# EAGLE design IO_board-ha-v3-rev1 (EAGLE 6.5.0)
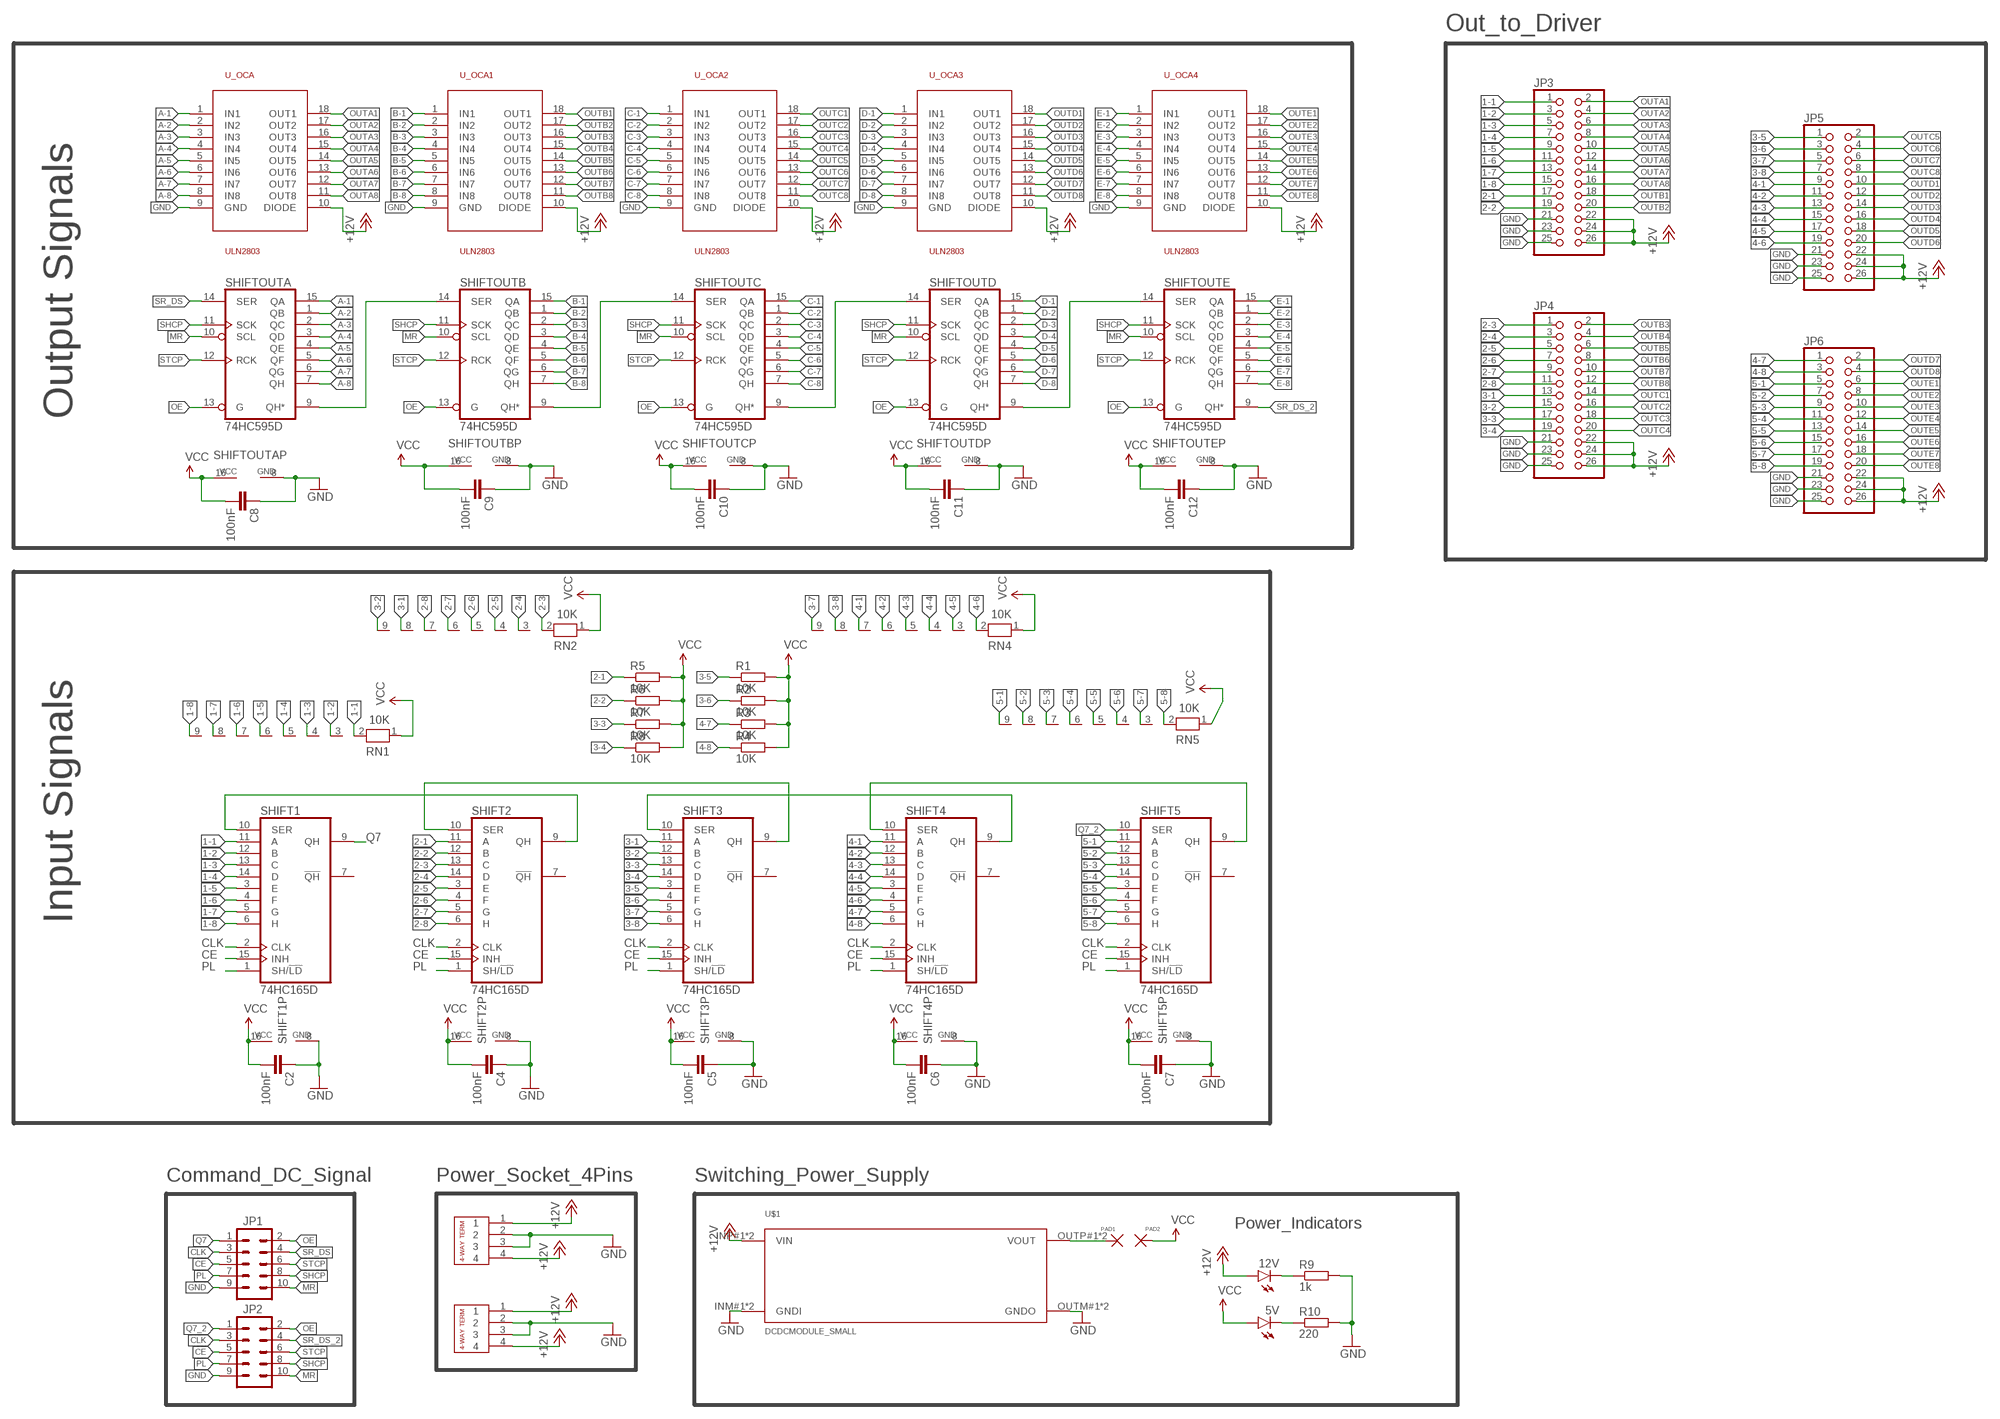
[diagram p0: schematic, sheet 1]

## Parts
5V  LED3MM  [LED3MM]
12V  LED3MM  [LED3MM]
C2  100nF  C-EUC0603K  [C0603K]
C4  100nF  C-EUC0603K  [C0603K]
C5  100nF  C-EUC0603K  [C0603K]
C6  100nF  C-EUC0603K  [C0603K]
C7  100nF  C-EUC0603K  [C0603K]
C8  100nF  C-EUC0603K  [C0603K]
C9  100nF  C-EUC0603K  [C0603K]
C10  100nF  C-EUC0603K  [C0603K]
C11  100nF  C-EUC0603K  [C0603K]
C12  100nF  C-EUC0603K  [C0603K]
J1  4-PIN-CON-1759017  [4-PIN-CON-1759017]
J2  4-PIN-CON-1759017  [4-PIN-CON-1759017]
JP1  M05X2SHD  [2X5-SHROUDED]
JP2  M05X2SHD  [2X5-SHROUDED]
JP3  PINHD-2X13  [2X13]
JP4  PINHD-2X13  [2X13]
JP5  PINHD-2X13  [2X13]
JP6  PINHD-2X13  [2X13]
R1  10K  R-EU_R0603  [R0603]
R2  10K  R-EU_R0603  [R0603]
R3  10K  R-EU_R0603  [R0603]
R4  10K  R-EU_R0603  [R0603]
R5  10K  R-EU_R0603  [R0603]
R6  10K  R-EU_R0603  [R0603]
R7  10K  R-EU_R0603  [R0603]
R8  10K  R-EU_R0603  [R0603]
R9  1k  R-EU_R0805  [R0805]
R10  220  R-EU_R0805  [R0805]
RN1  10K  RN08  [RN-9]
RN2  10K  RN08  [RN-9]
RN4  10K  RN08  [RN-9]
RN5  10K  RN08  [RN-9]
SHIFT1  74HC165D  [SO16]
SHIFT2  74HC165D  [SO16]
SHIFT3  74HC165D  [SO16]
SHIFT4  74HC165D  [SO16]
SHIFT5  74HC165D  [SO16]
SHIFTOUTA  74HC595D  [SO16]
SHIFTOUTB  74HC595D  [SO16]
SHIFTOUTC  74HC595D  [SO16]
SHIFTOUTD  74HC595D  [SO16]
SHIFTOUTE  74HC595D  [SO16]
U$1  DCDCMODULE_SMALL  [DCDCMODULE-SMALL]
U$2  DOUBLE_SMALL_PAD  [DOUBLE_SMALL_PAD]
U_OCA  ULN2803  [SO18L]
U_OCA1  ULN2803  [SO18L]
U_OCA2  ULN2803  [SO18L]
U_OCA3  ULN2803  [SO18L]
U_OCA4  ULN2803  [SO18L]

## Nets
1-1: JP3.1 RN1.2 SHIFT1.11(A)
1-2: JP3.3 RN1.3 SHIFT1.12(B)
1-3: JP3.5 RN1.4 SHIFT1.13(C)
1-4: JP3.7 RN1.5 SHIFT1.14(D)
1-5: JP3.9 RN1.6 SHIFT1.3(E)
1-6: JP3.11 RN1.7 SHIFT1.4(F)
1-7: JP3.13 RN1.8 SHIFT1.5(G)
1-8: JP3.15 RN1.9 SHIFT1.6(H)
2-1: JP3.17 R5.1 SHIFT2.11(A)
2-2: JP3.19 R6.1 SHIFT2.12(B)
2-3: JP4.1 RN2.2 SHIFT2.13(C)
2-4: JP4.3 RN2.3 SHIFT2.14(D)
2-5: JP4.5 RN2.4 SHIFT2.3(E)
2-6: JP4.7 RN2.5 SHIFT2.4(F)
2-7: JP4.9 RN2.6 SHIFT2.5(G)
2-8: JP4.11 RN2.7 SHIFT2.6(H)
3-1: JP4.13 RN2.8 SHIFT3.11(A)
3-2: JP4.15 RN2.9 SHIFT3.12(B)
3-3: JP4.17 R7.1 SHIFT3.13(C)
3-4: JP4.19 R8.1 SHIFT3.14(D)
3-5: JP5.1 R1.1 SHIFT3.3(E)
3-6: JP5.3 R2.1 SHIFT3.4(F)
3-7: JP5.5 RN4.9 SHIFT3.5(G)
3-8: JP5.7 RN4.8 SHIFT3.6(H)
4-1: JP5.9 RN4.7 SHIFT4.11(A)
4-2: JP5.11 RN4.6 SHIFT4.12(B)
4-3: JP5.13 RN4.5 SHIFT4.13(C)
4-4: JP5.15 RN4.4 SHIFT4.14(D)
4-5: JP5.17 RN4.3 SHIFT4.3(E)
4-6: JP5.19 RN4.2 SHIFT4.4(F)
4-7: JP6.1 R3.1 SHIFT4.5(G)
4-8: JP6.3 R4.1 SHIFT4.6(H)
5-1: JP6.5 RN5.9 SHIFT5.11(A)
5-2: JP6.7 RN5.8 SHIFT5.12(B)
5-3: JP6.9 RN5.7 SHIFT5.13(C)
5-4: JP6.11 RN5.6 SHIFT5.14(D)
5-5: JP6.13 RN5.5 SHIFT5.3(E)
5-6: JP6.15 RN5.4 SHIFT5.4(F)
5-7: JP6.17 RN5.3 SHIFT5.5(G)
5-8: JP6.19 RN5.2 SHIFT5.6(H)
+12V [power]: 12V.A J1.1 J1.4 J2.1 J2.4 JP3.22 JP3.24 JP3.26 JP4.22 JP4.24 JP4.26 JP5.22 JP5.24 JP5.26 JP6.22 JP6.24 JP6.26 U$1.INP#1(VIN) U$1.INP#2(VIN) U_OCA1.10(DIODE) U_OCA2.10(DIODE) U_OCA3.10(DIODE) U_OCA4.10(DIODE) U_OCA.10(DIODE)
A-1: SHIFTOUTA.15(QA) U_OCA.1(IN1)
A-2: SHIFTOUTA.1(QB) U_OCA.2(IN2)
A-3: SHIFTOUTA.2(QC) U_OCA.3(IN3)
A-4: SHIFTOUTA.3(QD) U_OCA.4(IN4)
A-5: SHIFTOUTA.4(QE) U_OCA.5(IN5)
A-6: SHIFTOUTA.5(QF) U_OCA.6(IN6)
A-7: SHIFTOUTA.6(QG) U_OCA.7(IN7)
A-8: SHIFTOUTA.7(QH) U_OCA.8(IN8)
B-1: SHIFTOUTB.15(QA) U_OCA1.1(IN1)
B-2: SHIFTOUTB.1(QB) U_OCA1.2(IN2)
B-3: SHIFTOUTB.2(QC) U_OCA1.3(IN3)
B-4: SHIFTOUTB.3(QD) U_OCA1.4(IN4)
B-5: SHIFTOUTB.4(QE) U_OCA1.5(IN5)
B-6: SHIFTOUTB.5(QF) U_OCA1.6(IN6)
B-7: SHIFTOUTB.6(QG) U_OCA1.7(IN7)
B-8: SHIFTOUTB.7(QH) U_OCA1.8(IN8)
C-1: SHIFTOUTC.15(QA) U_OCA2.1(IN1)
C-2: SHIFTOUTC.1(QB) U_OCA2.2(IN2)
C-3: SHIFTOUTC.2(QC) U_OCA2.3(IN3)
C-4: SHIFTOUTC.3(QD) U_OCA2.4(IN4)
C-5: SHIFTOUTC.4(QE) U_OCA2.5(IN5)
C-6: SHIFTOUTC.5(QF) U_OCA2.6(IN6)
C-7: SHIFTOUTC.6(QG) U_OCA2.7(IN7)
C-8: SHIFTOUTC.7(QH) U_OCA2.8(IN8)
CE: JP1.5 JP2.5 SHIFT1.15(INH) SHIFT2.15(INH) SHIFT3.15(INH) SHIFT4.15(INH) SHIFT5.15(INH)
CLK: JP1.3 JP2.3 SHIFT1.2(CLK) SHIFT2.2(CLK) SHIFT3.2(CLK) SHIFT4.2(CLK) SHIFT5.2(CLK)
D-1: SHIFTOUTD.15(QA) U_OCA3.1(IN1)
D-2: SHIFTOUTD.1(QB) U_OCA3.2(IN2)
D-3: SHIFTOUTD.2(QC) U_OCA3.3(IN3)
D-4: SHIFTOUTD.3(QD) U_OCA3.4(IN4)
D-5: SHIFTOUTD.4(QE) U_OCA3.5(IN5)
D-6: SHIFTOUTD.5(QF) U_OCA3.6(IN6)
D-7: SHIFTOUTD.6(QG) U_OCA3.7(IN7)
D-8: SHIFTOUTD.7(QH) U_OCA3.8(IN8)
E-1: SHIFTOUTE.15(QA) U_OCA4.1(IN1)
E-2: SHIFTOUTE.1(QB) U_OCA4.2(IN2)
E-3: SHIFTOUTE.2(QC) U_OCA4.3(IN3)
E-4: SHIFTOUTE.3(QD) U_OCA4.4(IN4)
E-5: SHIFTOUTE.4(QE) U_OCA4.5(IN5)
E-6: SHIFTOUTE.5(QF) U_OCA4.6(IN6)
E-7: SHIFTOUTE.6(QG) U_OCA4.7(IN7)
E-8: SHIFTOUTE.7(QH) U_OCA4.8(IN8)
GND [GND]: C2.1 C4.1 C5.1 C6.1 C7.1 C8.1 C9.1 C10.1 C11.1 C12.1 J1.2 J1.3 J2.2 J2.3 JP1.9 JP2.9 JP3.21 JP3.23 JP3.25 JP4.21 JP4.23 JP4.25 JP5.21 JP5.23 JP5.25 JP6.21 JP6.23 JP6.25 R9.2 R10.2 SHIFT1.8(GND) SHIFT2.8(GND) SHIFT3.8(GND) SHIFT4.8(GND) SHIFT5.8(GND) SHIFTOUTA.8(GND) SHIFTOUTB.8(GND) SHIFTOUTC.8(GND) SHIFTOUTD.8(GND) SHIFTOUTE.8(GND) U$1.INM#1(GNDI) U$1.INM#2(GNDI) U$1.OUTM#1(GNDO) U$1.OUTM#2(GNDO) U_OCA1.9(GND) U_OCA2.9(GND) U_OCA3.9(GND) U_OCA4.9(GND) U_OCA.9(GND)
MR [power]: JP1.10 JP2.10 SHIFTOUTA.10(SCL) SHIFTOUTB.10(SCL) SHIFTOUTC.10(SCL) SHIFTOUTD.10(SCL) SHIFTOUTE.10(SCL)
N$12: U$1.OUTP#1(VOUT) U$1.OUTP#2(VOUT) U$2.PAD1
N$13: 12V.K(C) R9.1
N$17: 5V.K(C) R10.1
N$18: SHIFT2.10(SER) SHIFT3.9(QH)
N$21: SHIFT3.10(SER) SHIFT4.9(QH)
N$22: SHIFT4.10(SER) SHIFT5.9(QH)
N$26: SHIFTOUTA.9(QH*) SHIFTOUTB.14(SER)
N$31: SHIFTOUTC.9(QH*) SHIFTOUTD.14(SER)
N$37: SHIFTOUTB.9(QH*) SHIFTOUTC.14(SER)
N$38: SHIFTOUTD.9(QH*) SHIFTOUTE.14(SER)
N$50: SHIFT1.10(SER) SHIFT2.9(QH)
OE [GND]: JP1.2 JP2.2 SHIFTOUTA.13(G) SHIFTOUTB.13(G) SHIFTOUTC.13(G) SHIFTOUTD.13(G) SHIFTOUTE.13(G)
OUTA1: JP3.2 U_OCA.18(OUT1)
OUTA2: JP3.4 U_OCA.17(OUT2)
OUTA3: JP3.6 U_OCA.16(OUT3)
OUTA4: JP3.8 U_OCA.15(OUT4)
OUTA5: JP3.10 U_OCA.14(OUT5)
OUTA6: JP3.12 U_OCA.13(OUT6)
OUTA7: JP3.14 U_OCA.12(OUT7)
OUTA8: JP3.16 U_OCA.11(OUT8)
OUTB1: JP3.18 U_OCA1.18(OUT1)
OUTB2: JP3.20 U_OCA1.17(OUT2)
OUTB3: JP4.2 U_OCA1.16(OUT3)
OUTB4: JP4.4 U_OCA1.15(OUT4)
OUTB5: JP4.6 U_OCA1.14(OUT5)
OUTB6: JP4.8 U_OCA1.13(OUT6)
OUTB7: JP4.10 U_OCA1.12(OUT7)
OUTB8: JP4.12 U_OCA1.11(OUT8)
OUTC1: JP4.14 U_OCA2.18(OUT1)
OUTC2: JP4.16 U_OCA2.17(OUT2)
OUTC3: JP4.18 U_OCA2.16(OUT3)
OUTC4: JP4.20 U_OCA2.15(OUT4)
OUTC5: JP5.2 U_OCA2.14(OUT5)
OUTC6: JP5.4 U_OCA2.13(OUT6)
OUTC7: JP5.6 U_OCA2.12(OUT7)
OUTC8: JP5.8 U_OCA2.11(OUT8)
OUTD1: JP5.10 U_OCA3.18(OUT1)
OUTD2: JP5.12 U_OCA3.17(OUT2)
OUTD3: JP5.14 U_OCA3.16(OUT3)
OUTD4: JP5.16 U_OCA3.15(OUT4)
OUTD5: JP5.18 U_OCA3.14(OUT5)
OUTD6: JP5.20 U_OCA3.13(OUT6)
OUTD7: JP6.2 U_OCA3.12(OUT7)
OUTD8: JP6.4 U_OCA3.11(OUT8)
OUTE1: JP6.6 U_OCA4.18(OUT1)
OUTE2: JP6.8 U_OCA4.17(OUT2)
OUTE3: JP6.10 U_OCA4.16(OUT3)
OUTE4: JP6.12 U_OCA4.15(OUT4)
OUTE5: JP6.14 U_OCA4.14(OUT5)
OUTE6: JP6.16 U_OCA4.13(OUT6)
OUTE7: JP6.18 U_OCA4.12(OUT7)
OUTE8: JP6.20 U_OCA4.11(OUT8)
PL: JP1.7 JP2.7 SHIFT1.1(SH/!LD) SHIFT2.1(SH/!LD) SHIFT3.1(SH/!LD) SHIFT4.1(SH/!LD) SHIFT5.1(SH/!LD)
Q7: JP1.1 SHIFT1.9(QH)
Q7_2: JP2.1 SHIFT5.10(SER)
SHCP: JP1.8 JP2.8 SHIFTOUTA.11(SCK) SHIFTOUTB.11(SCK) SHIFTOUTC.11(SCK) SHIFTOUTD.11(SCK) SHIFTOUTE.11(SCK)
SR_DS: JP1.4 SHIFTOUTA.14(SER)
SR_DS_2: JP2.4 SHIFTOUTE.9(QH*)
STCP: JP1.6 JP2.6 SHIFTOUTA.12(RCK) SHIFTOUTB.12(RCK) SHIFTOUTC.12(RCK) SHIFTOUTD.12(RCK) SHIFTOUTE.12(RCK)
VCC [power]: 5V.A C2.2 C4.2 C5.2 C6.2 C7.2 C8.2 C9.2 C10.2 C11.2 C12.2 R1.2 R2.2 R3.2 R4.2 R5.2 R6.2 R7.2 R8.2 RN1.1 RN2.1 RN4.1 RN5.1 SHIFT1.16(VCC) SHIFT2.16(VCC) SHIFT3.16(VCC) SHIFT4.16(VCC) SHIFT5.16(VCC) SHIFTOUTA.16(VCC) SHIFTOUTB.16(VCC) SHIFTOUTC.16(VCC) SHIFTOUTD.16(VCC) SHIFTOUTE.16(VCC) U$2.PAD2
Unconnected: SHIFT1.7(!QH) SHIFT2.7(!QH) SHIFT3.7(!QH) SHIFT4.7(!QH) SHIFT5.7(!QH)

## Notes on the sheet
- Out_to_Driver
- Output Signals
- Input Signals
- Command_DC_Signal | Power_Socket_4Pins | Switching_Power_Supply
- Power_Indicators

## Library data of the parts
5V 12V = SparkFun-LED:LED: LEDs Standard schematic elements and footprints for 5mm, 3mm, 1206, and 0603 sized LEDs. 5mm - Spark Fun Electronics SKU : COM-00529 (and others)
C2 C4-C12 = rcl:C-EU: CAPACITOR, European symbol
J1 J2 = maul:4-PIN-CON-1759017
JP1 JP2 = SparkFun-Connectors:M05X2: Header 5x2 Standard 10-pin dual row 0.1" header. Commonly used with AVR-ISP. Use with Spark Fun Electronics SKU: PRT-00778
JP3-JP6 = pinhead:PINHD-2X13: PIN HEADER
R1-R8 = resistor:R-EU_: RESISTOR, European symbol
R9 R10 = rcl:R-EU_: RESISTOR, European symbol
RN1 RN2 RN4 RN5 = resistor-net:RN08: RESISTOR NETWORK; OC_FARNELL: unknown; OC_NEWARK: unknown
SHIFT1-SHIFT5 = 74xx-eu:74*165: 8-bit parallel load SHIFT REGISTER
SHIFTOUTA SHIFTOUTB SHIFTOUTC SHIFTOUTD SHIFTOUTE = 74xx-eu:74*595: 8-bit SHIFT REGISTER, output latch
U$1 = bontor:DCDCMODULE_SMALL
U$2 = maul:DOUBLE_SMALL_PAD
U_OCA U_OCA1-U_OCA4 = uln2803:ULN2803

## Net classes
1 power: width 0.305 mm, drill 0.6 mm, clearance 0.813 mm
2 GND: width 0.305 mm, drill 0.6 mm, clearance 0.508 mm
3 LIVEAC: width 0.508 mm, drill 0.508 mm, clearance 1.27 mm

## Board
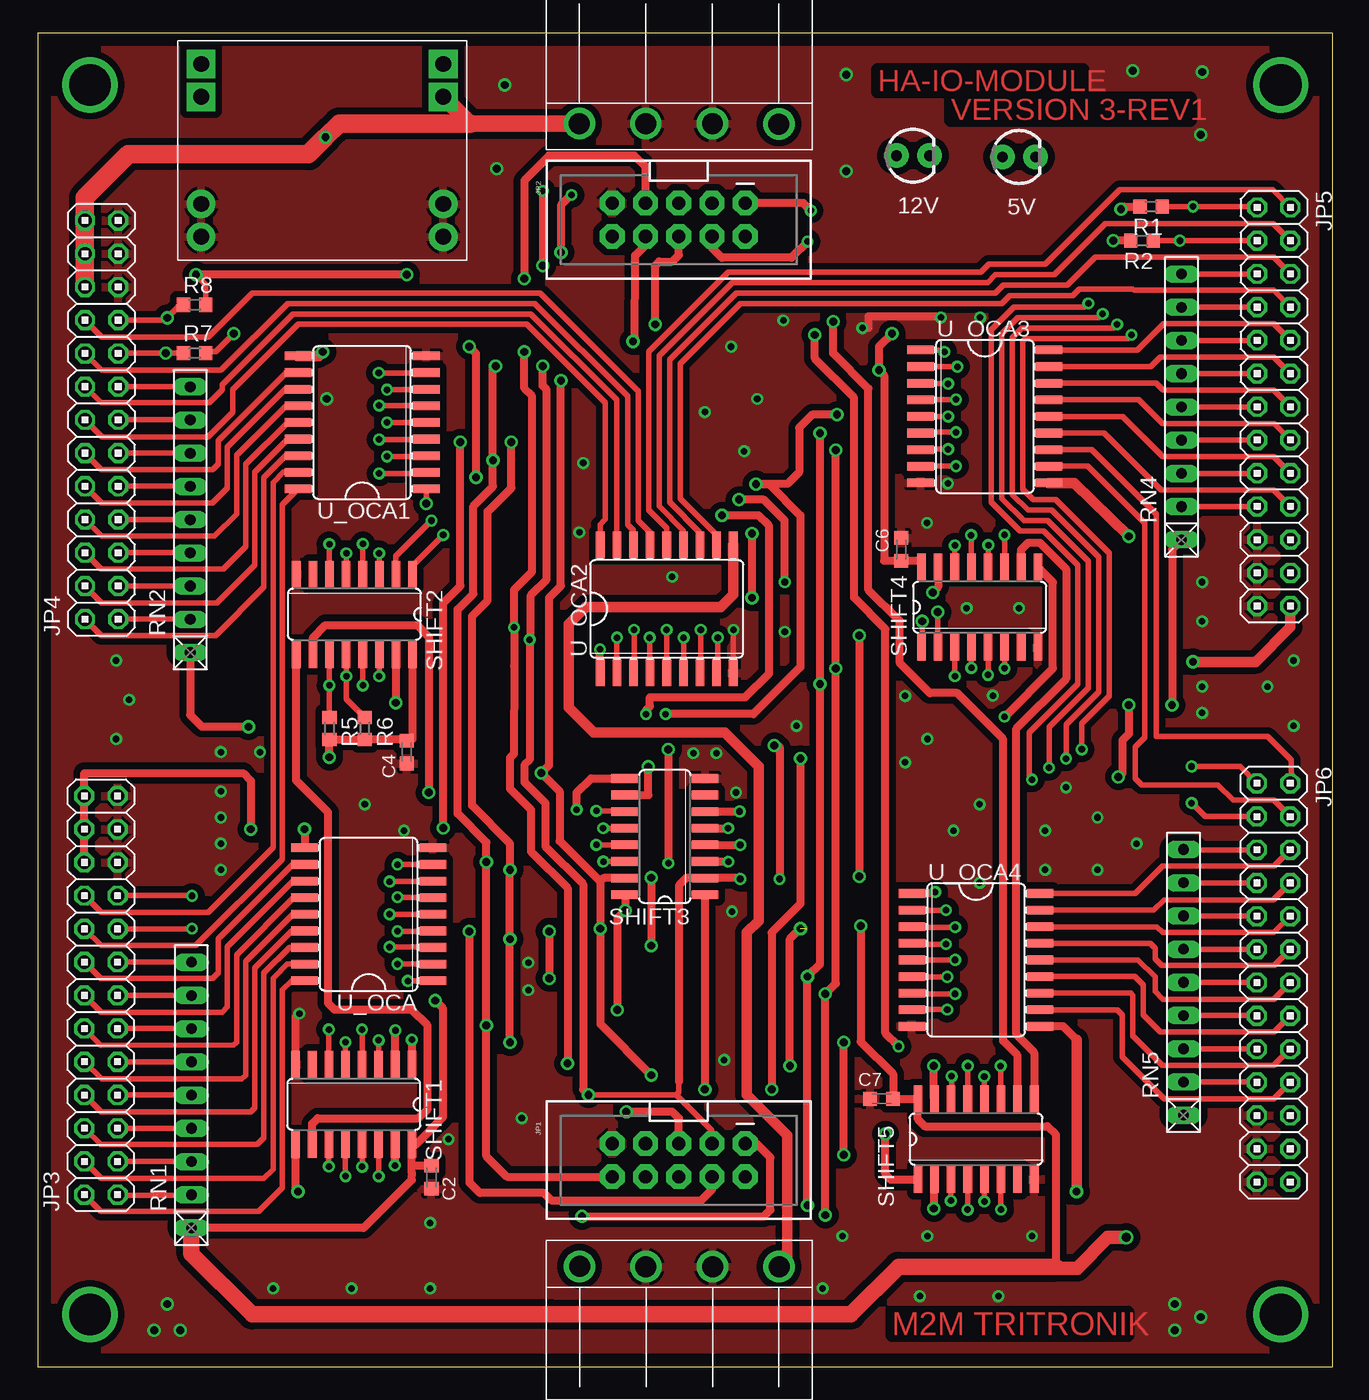
[diagram p1: board, top side]
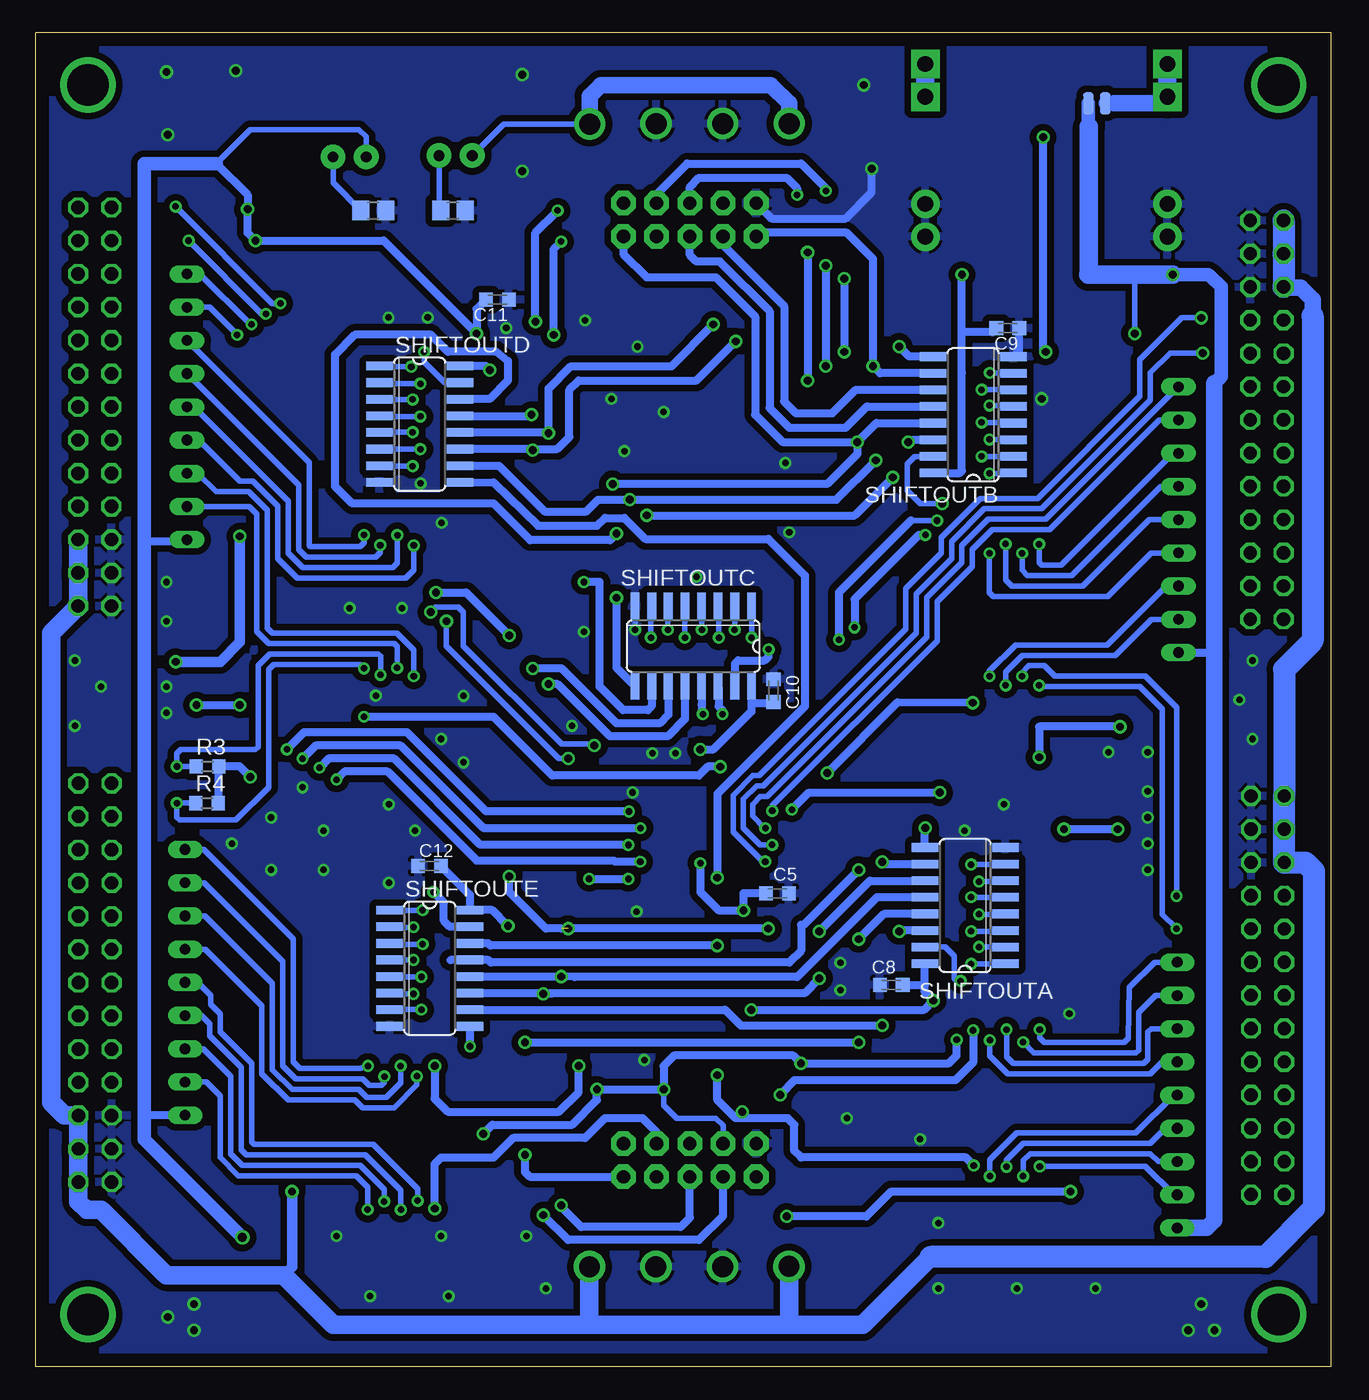
[diagram p2: board, bottom side, seen from below]

Size 99 x 102 mm. Coordinates in mm from the lower left corner, seen from the top.
Outline: 99,0 99,102 0,102 0,0 99,0
Copper layers (1*16): Top 0.035mm / dielectric 1.5mm / Bottom 0.035mm
Design rules "default": minimum track width 10mil, minimum drill 24mil, track to track 8mil, track to pad 8mil, pad to pad 8mil, via to via 8mil, smd to smd 8mil, copper to edge 40mil, drill to drill 8mil, minimum pad ring 10mil, minimum via ring 8mil, stop-mask expansion 4mil, vias tented up to drill 0mil, thermal gap 10mil

### Footprints (pad centres in the part's own frame; a part is rotated, then mirrored left to right if it is on the bottom)
LED3MM = drill 0.813 pad 1.88: A -1.27,0; K 1.27,0
C0603K = smd 1.05 x 1.08: 1 -0.875,0; 2 0.875,0
4-PIN-CON-1759017 = drill 1.6: 1 -7.62,4.13; 2 -2.55,4.1; 3 2.55,4.1; 4 7.63,4.1
2X5-SHROUDED = drill 1.016 pad 1.88 octagon: 1 -1.27,5.08; 2 1.27,5.08; 3 -1.27,2.54; 4 1.27,2.54; 5 -1.27,0; 6 1.27,0; 7 -1.27,-2.54; 8 1.27,-2.54; 9 -1.27,-5.08; 10 1.27,-5.08
2X13 = drill 1.016 octagon: 1 -15.24,-1.27; 2 -15.24,1.27; 3 -12.7,-1.27; 4 -12.7,1.27; 5 -10.16,-1.27; 6 -10.16,1.27; 7 -7.62,-1.27; 8 -7.62,1.27; 9 -5.08,-1.27; 10 -5.08,1.27; 11 -2.54,-1.27; 12 -2.54,1.27; 13 0,-1.27; 14 0,1.27; 15 2.54,-1.27; 16 2.54,1.27; 17 5.08,-1.27; 18 5.08,1.27; 19 7.62,-1.27; 20 7.62,1.27; 21 10.16,-1.27; 22 10.16,1.27; 23 12.7,-1.27; 24 12.7,1.27; 25 15.24,-1.27; 26 15.24,1.27
R0603 = smd 1 x 1.1: 1 -0.85,0; 2 0.85,0
R0805 = smd 1.3 x 1.5: 1 -0.95,0; 2 0.95,0
RN-9 = drill 0.813 long: 1 -10.16,0; 2 -7.62,0; 3 -5.08,0; 4 -2.54,0; 5 0,0; 6 2.54,0; 7 5.08,0; 8 7.62,0; 9 10.16,0
SO16 = smd 0.66 x 2.032: 1 -4.445,-3.073; 2 -3.175,-3.073; 3 -1.905,-3.073; 4 -0.635,-3.073; 5 0.635,-3.073; 6 1.905,-3.073; 7 3.175,-3.073; 8 4.445,-3.073; 9 4.445,3.073; 10 3.175,3.073; 11 1.905,3.073; 12 0.635,3.073; 13 -0.635,3.073; 14 -1.905,3.073; 15 -3.175,3.073; 16 -4.445,3.073
DCDCMODULE-SMALL = drill 1.2 pad 2.184: INM#1 1.8,15; INM#2 1.8,12.5; OUTM#1 20.3,15; OUTM#2 20.3,12.5 | drill 1.2 pad 2.184 square: INP#1 1.8,4.3; INP#2 1.8,1.8; OUTP#1 20.3,4.3; OUTP#2 20.3,1.8
DOUBLE_SMALL_PAD = smd 0.813 x 1.676: PAD1 -0.635,0; PAD2 0.635,0
SO18L = smd 0.66 x 2.032: 1 -5.08,-4.902; 2 -3.81,-4.902; 3 -2.54,-4.902; 4 -1.27,-4.902; 5 0,-4.902; 6 1.27,-4.902; 7 2.54,-4.902; 8 3.81,-4.902; 9 5.08,-4.902; 10 5.08,4.902; 11 3.81,4.902; 12 2.54,4.902; 13 1.27,4.902; 14 0,4.902; 15 -1.27,4.902; 16 -2.54,4.902; 17 -3.81,4.902; 18 -5.08,4.902

### Placement (x,y rotation side)
5V  75,92.5 0 top
12V  66.9,92.6 0 top
C2  30.1,14.5 90 top
C4  28.2,47 90 top
C5  42.3,36.2 180 bottom
C6  66,62.5 270 top
C7  64.5,20.5 0 top
C8  33.6,29.2 0 bottom
C9  24.7,79.4 180 bottom
C10  42.6,51.7 270 bottom
C11  63.7,81.6 180 bottom
C12  68.9,38.3 0 bottom
J1  49.03,99.15 180 top
J2  49.04,3.55 0 top
JP1  49,15.8 270 top
JP2  49,87.7 270 top
JP3  4.84,28.4 90 top
JP4  4.89,72.4 90 top
JP5  94.48,73.4 270 top
JP6  94.46,29.37 270 top
R1  85.1,88.7 180 top
R2  84.4,86.1 180 top
R3  85.86,45.9 0 bottom
R4  85.9,43.1 0 bottom
R5  22.3,48.8 270 top
R6  25,48.8 270 top
R7  12,77.5 0 top
R8  12,81.2 0 top
R9  67.1,88.4 0 bottom
R10  73.2,88.4 0 bottom
RN1  11.75,20.77 90 top
RN2  11.66,64.77 90 top
RN4  87.42,73.39 90 top
RN5  87.57,29.39 90 top
SHIFT1  24.16,20.06 180 top
SHIFT2  24.21,57.53 180 top
SHIFT3  47.94,40.54 90 top
SHIFT4  72,58.08 0 top
SHIFT5  71.72,17.41 0 top
SHIFTOUTA  27.96,35.26 90 bottom
SHIFTOUTB  27.34,72.79 90 bottom
SHIFTOUTC  48.74,55.09 180 bottom
SHIFTOUTD  69.65,72.07 270 bottom
SHIFTOUTE  68.88,30.47 270 bottom
U$1  32.8,101.4 180 top
U$2  17.9,96.6 180 bottom
U_OCA  25.3,34.6 90 top
U_OCA1  24.8,72.2 90 top
U_OCA2  48.08,57.95 0 top
U_OCA3  72.39,72.66 270 top
U_OCA4  71.72,31.11 270 top

### Tracks (layer width: path | path; a pad name or v marks a point on that pad's centre or on a via)
1-1  (via drill 0.5)
  Top 0.406: SHIFT1.11 v22.25,15.32 | JP3.1 6.34,13.16 6.4,13.1 11.7,13.1 RN1.2
  Bottom 0.406: v22.25,15.32 14.18,15.32 11.98,13.15 RN1.2
1-2  (via drill 0.5)
  Top 0.406: SHIFT1.12 v23.52,14.57 | JP3.3 RN1.3
  Bottom 0.406: v23.52,14.57 23.52,15.78 23,16.3 13.8,16.3 13.2,15.7 RN1.3
1-3  (via drill 0.5)
  Top 0.406: SHIFT1.13 v24.8,15.3 | JP3.5 RN1.4
  Bottom 0.406: v24.8,15.3 24.8,15.8 23.5,17.1 13.8,17.1 12.67,18.23 RN1.4
1-4  (via drill 0.5)
  Top 0.406: SHIFT1.14 v26.07,14.56 | JP3.7 RN1.5
  Bottom 0.406: v26.07,14.56 26.07,15.84 24,17.9 14.9,17.9 12.03,20.77 RN1.5
1-5  (via drill 0.5)
  Top 0.406: SHIFT1.3 v26.07,24.96 | JP3.9 RN1.6
  Bottom 0.406: v26.07,24.96 26.07,23.77 24.7,22.4 13.8,22.4 12.89,23.31 RN1.6
1-6  (via drill 0.5)
  Top 0.406: SHIFT1.4 v24.8,25.8 | JP3.11 RN1.7
  Bottom 0.406: v24.8,25.8 24.8,23.7 24.3,23.2 14.3,23.2 14,23.5 14,25.6 13.75,25.85 RN1.7 12.05,25.85
1-7  (via drill 0.5)
  Top 0.406: SHIFT1.5 v23.52,24.82 | JP3.13 RN1.8
  Bottom 0.406: v23.52,24.82 22.7,24 14.9,24 14.7,24.2 14.7,27.1 13.4,28.4 RN1.8 11.91,28.39
1-8  (via drill 0.5)
  Top 0.406: SHIFT1.6 v22.25,25.8 | JP3.15 RN1.9
  Bottom 0.406: v22.25,25.8 22.25,25.16 21.9,24.8 15.8,24.8 15.5,25.1 15.4,29 13.47,30.93 RN1.9 11.97,30.93
2-1  (via drill 0.5)
  Top 0.406: v11.8,33.5 11.78,33.48 JP3.17 | SHIFT2.11 v22.3,52.1 R5.1
  Bottom 0.406: v11.8,33.5 12.9,34.6 12.9,50.3 14.6,52 22.2,52 v22.3,52.1
2-2  (via drill 0.5)
  Top 0.406: SHIFT2.12 23.6,54.46 v23.6,52.8 23.6,51.05 R6.1 | v11.8,36 11.42,36.02 JP3.19
  Bottom 0.406: v23.6,52.8 23.6,53.1 23.1,53.6 21.9,53.6 21.1,52.8 14.2,52.8 11.8,50.4 v11.8,36
2-3  (via drill 0.5)
  Top 0.406: JP4.1 RN2.2 | SHIFT2.13 24.86,54.44 v24.86,52.1
  Bottom 0.406: v24.86,52.1 24.86,53.14 23.6,54.4 16.5,54.4 13.75,57.15 RN2.2
2-4  (via drill 0.5)
  Top 0.406: JP4.3 RN2.3 | SHIFT2.14 26.1,54.44 v26.1,52.8
  Bottom 0.406: v26.1,52.8 26.1,53.2 24.1,55.2 17.1,55.2 12.6,59.7 RN2.3
2-5  (via drill 0.5)
  Top 0.406: JP4.5 RN2.4 | SHIFT2.3 26.1,60.62 v26.1,62.2
  Bottom 0.406: v26.1,62.2 26.1,59.2 25.8,58.9 17.06,58.9 13.73,62.23 RN2.4
2-6  (via drill 0.5)
  Top 0.406: JP4.7 RN2.5 | SHIFT2.4 24.86,60.62 v24.86,62.91
  Bottom 0.406: v24.86,62.91 24.86,60.16 24.4,59.7 18.97,59.7 13.9,64.77 RN2.5
2-7  (via drill 0.5)
  Top 0.406: JP4.9 RN2.6 | SHIFT2.5 23.6,60.63 v23.6,62.2
  Bottom 0.406: 11.69,67.31 RN2.6 13,67.3 19.8,60.5 23.2,60.5 23.6,60.9 v23.6,62.2
2-8  (via drill 0.5)
  Top 0.406: JP4.11 RN2.7 | SHIFT2.6 v22.3,62.9
  Bottom 0.406: v22.3,62.9 22.3,61.5 22.1,61.3 20.6,61.3 12.05,69.85 RN2.7
3-1  (via drill 0.5)
  Top 0.406: JP4.13 RN2.8 | SHIFT3.11 44.66,42.45 44.6,42.5 v42.7,42.5
  Bottom 0.406: RN2.8 13.11,72.39 21.5,64 25.9,64 27.4,62.5 27.4,61.2 30.1,58.5 30.1,55.5 42.7,42.9 v42.7,42.5
3-2  (via drill 0.5)
  Top 0.406: JP4.15 RN2.9 | SHIFT3.12 v43.23,41.17
  Bottom 0.406: v43.23,41.17 43.27,41.17 44.2,42.1 44.2,43 43.6,43.6 43.1,43.6 30.9,55.8 30.9,58.8 28.2,61.5 28.2,62.8 26.2,64.8 21.8,64.8 RN2.9
3-3  (via drill 0.5, 0.6)
  Top 0.406: SHIFT3.13 v42.7,39.91 | JP4.17 6.18,77.5 v9.8,77.5 R7.1
  Bottom 0.406: v42.7,39.91 43.6,39.91 44.9,41.2 44.9,43.4 43.9,44.4 43.4,44.4 31.7,56.1 31.7,59.1 29,61.8 29,63.1 26.5,65.6 22.1,65.6 13.8,73.9 13.8,76 12.3,77.5 v9.8,77.5
3-4  (via drill 0.5, 0.6)
  Top 0.406: SHIFT3.14 v43.23,38.63 | JP4.19 9.72,80.02 v9.9,80.2 10.9,81.2 R8.1
  Bottom 0.406: v43.23,38.63 43.44,38.63 45.7,40.9 45.7,43.7 44.2,45.2 43.7,45.2 32.5,56.4 32.5,59.5 29.8,62.2 29.8,63.4 26.8,66.4 22.4,66.4 14.6,74.2 14.6,77.02 11.42,80.2 v9.9,80.2
3-5  (via drill 0.5)
  Top 0.406: v80.3,81.3 80,81 74.6,81 72.9,79.3 72.9,66.1 75.1,63.9 76.9,63.9 79.5,61.3 79.5,52.2 75.8,48.5 75.8,45.1 v76,44.9 | R1.1 v88.3,88.7 93.15,88.7 JP5.1
  Top 0.61: SHIFT3.3 51.03,38.62 v52.79,38.62
  Bottom 0.406: v80.3,81.3 80.9,81.3 v88.3,88.7 | 93.15,88.7 JP5.1
  Bottom 0.61: v76,44.9 75.4,45.5 72.1,45.5 65.3,38.7 54.8,38.7 54.72,38.62 v52.79,38.62
3-6  (via drill 0.5)
  Top 0.406: JP5.3 v87.3,86.1 R2.1 | v81.4,80.5 81.1,80.2 74.9,80.2 73.7,79 73.7,66.4 75.4,64.7 77.2,64.7 80.3,61.6 80.3,51.9 77.3,48.9 v77.3,45.8
  Top 0.61: SHIFT3.4 v53.7,39.9
  Bottom 0.406: v81.4,80.5 81.7,80.5 v87.3,86.1
  Bottom 0.61: v53.7,39.9 65,39.9 71.6,46.5 76.6,46.5 v77.3,45.8
3-7  (via drill 0.5)
  Top 0.406: RN4.9 JP5.5 | v82.5,79.7 82.2,79.4 75.2,79.4 74.5,78.7 74.5,66.7 75.7,65.5 77.5,65.5 81.1,61.9 81.1,51.6 78.6,49.1 v78.6,46.5
  Top 0.61: SHIFT3.5 v52.77,41.17
  Bottom 0.406: v82.5,79.7 82.6,79.7 86.45,83.55 RN4.9
  Bottom 0.61: v52.77,41.17 64.67,41.17 64.7,41.2 64.8,41.2 71.1,47.5 77.6,47.5 v78.6,46.5
3-8  (via drill 0.5)
  Top 0.406: RN4.8 JP5.7 | v83.6,78.9 83.3,78.6 75.5,78.6 75.3,78.4 75.3,67.1 76.1,66.3 77.8,66.3 81.9,62.2 81.9,51.3 79.8,49.2 v79.8,47.2
  Top 0.61: SHIFT3.6 51.03,42.46 v53.65,42.46
  Bottom 0.406: v83.6,78.9 85.71,81.01 RN4.8
  Bottom 0.61: v53.65,42.46 64.56,42.46 70.6,48.5 78.5,48.5 v79.8,47.2
4-1  (via drill 0.5)
  Top 0.406: RN4.7 JP5.9 | SHIFT4.11 73.91,62.99 v73.9,63.6
  Bottom 0.406: v73.9,63.6 73.9,63 74.2,62.7 78,62.7 78.1,62.8 78.1,69.15 RN4.7
4-2  (via drill 0.5)
  Top 0.406: RN4.6 JP5.11 | SHIFT4.12 72.66,61.18 v72.66,62.82
  Bottom 0.406: v72.66,62.82 72.66,62.24 73,61.9 78.3,61.9 78.9,62.5 78.9,67.41 RN4.6
4-3  (via drill 0.5)
  Top 0.406: RN4.5 JP5.13 | SHIFT4.13 71.35,61.17 v71.35,63.59
  Bottom 0.406: v71.35,63.59 71.35,61.45 71.7,61.1 78.6,61.1 79.7,62.2 79.7,66.2 86.89,73.39 RN4.5
4-4  (via drill 0.5)
  Top 0.406: RN4.4 JP5.15 | SHIFT4.14 70.09,62.99 v70.1,62.8
  Bottom 0.406: v70.1,62.8 70.1,60.9 70.7,60.3 79,60.3 80.5,61.8 80.5,65.8 82.4,67.7 83.4,67.7 86.55,70.85 RN4.4
4-5  (via drill 0.5)
  Top 0.406: RN4.3 JP5.17 | SHIFT4.3 v70.1,52.8
  Bottom 0.406: v70.1,52.8 70.1,54.8 71.4,56.1 80.9,56.1 81.3,56.5 81.3,65.5 82.7,66.9 85.2,66.9 86.6,68.3 RN4.3
4-6  (via drill 0.5)
  Top 0.406: RN4.2 JP5.19 | SHIFT4.4 v71.36,53.44
  Bottom 0.406: v71.36,53.44 71.36,55.06 71.6,55.3 81.2,55.3 82.1,56.2 82.1,65.2 82.67,65.77 RN4.2
4-7  (via drill 0.5)
  Top 0.406: SHIFT4.5 v72.64,52.9 | JP6.1 91.9,45.9 v88.2,45.9
  Bottom 0.406: v72.64,52.9 72.64,54.34 72.8,54.5 81.1,54.5 82,53.6 82,47.4 82.2,47.2 87.9,47.2 88.2,46.9 v88.2,45.9 R3.1
4-8  (via drill 0.5)
  Top 0.406: SHIFT4.6 v73.9,53.4 | JP6.3 89.23,42.07 v88.2,43.1
  Bottom 0.406: v73.9,53.4 74.2,53.7 80.8,53.7 81.2,53.3 81.2,44.3 83.7,41.8 88,41.8 88.2,42 v88.2,43.1 R4.1
5-1  (via drill 0.5)
  Top 0.406: RN5.9 87.95,39.55 88,39.5 93.16,39.5 JP6.5 | SHIFT5.11 73.6,20.51 v73.6,23
  Bottom 0.406: v73.6,23 74.2,22.8 78.8,22.8 79.3,23.3 79.3,32.7 86.15,39.55 RN5.9
5-2  (via drill 0.5)
  Top 0.406: RN5.8 93.17,37.01 JP6.7 | SHIFT5.12 v72.35,22.2
  Bottom 0.406: v72.35,22.2 72.35,21.75 72.6,21.5 73.5,21.5 74,22 79.1,22 80.1,23 80.1,31 86.1,37 RN5.8
5-3  (via drill 0.5)
  Top 0.406: RN5.7 93.17,34.47 JP6.9 | SHIFT5.13 71.1,20.5 v71.1,23
  Bottom 0.406: v71.1,23 71.1,21.7 72.2,20.6 73.7,20.6 74.3,21.2 79.4,21.2 80.9,22.7 80.9,29.3 86.07,34.47 RN5.7
5-4  (via drill 0.5)
  Top 0.406: RN5.6 93.17,31.93 JP6.11 | SHIFT5.14 69.86,20.53 v69.86,22.21
  Bottom 0.406: v69.86,22.21 69.86,21.54 71.6,19.8 74,19.8 74.6,20.4 79.7,20.4 81.7,22.4 81.7,27.6 86.03,31.93 RN5.6
5-5  (via drill 0.5)
  Top 0.406: RN5.5 93.17,29.39 JP6.13 | SHIFT5.3 69.8,14.32 v69.8,12.7
  Bottom 0.406: v69.8,12.7 69.8,13.6 73.2,17 82.3,17 82.5,17.2 82.5,23.2 84.9,25.6 84.9,27 85.6,27.7 85.6,28.4 86.59,29.39 RN5.5
5-6  (via drill 0.5)
  Top 0.406: RN5.4 93.17,26.85 JP6.15 | SHIFT5.4 v71.08,12.02
  Bottom 0.406: v71.08,12.02 71.08,13.48 73.8,16.2 82.9,16.2 83.3,16.6 83.3,22.9 85.7,25.3 85.7,26.2 86.35,26.85 RN5.4
5-7  (via drill 0.5)
  Top 0.406: RN5.3 93.17,24.31 JP6.17 | SHIFT5.5 v72.36,12.65
  Bottom 0.406: v72.36,12.65 72.36,13.56 74.2,15.4 83.2,15.4 84.1,16.3 84.1,22.2 86.2,24.3 RN5.3
5-8  (via drill 0.5)
  Top 0.406: RN5.2 93.17,21.77 JP6.19 | SHIFT5.6 v73.62,12.03
  Bottom 0.406: v73.62,12.03 73.62,13.72 74.5,14.6 83.5,14.6 84.9,16 84.9,20.7 85.97,21.77 RN5.2
+12V  (via drill 0.6)
  Top 0.61: 79.45,24.45 79.4,24.5 | 79.4,25 78.37,26.03 U_OCA4.10 | JP3.22 3.57,45.4 15.7,45.4 16.3,44.8 v16.3,41.1 | v20.4,41.1 U_OCA.10
  Top 0.813: U_OCA2.10 53.16,59.06 52.2,58.1 41.9,58.1 40.6,56.8 40.6,50.4 42.5,48.5 52.5,48.5 55.1,45.9 55.1,34.1 54.2,33.2 54.2,20.8 57.3,17.7 57.3,8.38 J2.4 | 79.4,25 79.4,24.5 v79.4,13.4 | U_OCA1.10 21.48,77.28 v21.8,77.6 | v88.3,53.9 93.1,53.9 95.75,56.55 JP5.26 | v83.4,63.5 79.22,67.58 U_OCA3.10
  Top 1.27: U$1.INP#1 33.05,95.05 J1.4
  Top 1.422: 33.05,95.05 23.05,95.05 v22,94 20.7,92.7 6.92,92.7 3.62,89.4 JP4.22
  Bottom 0.406: J1.1 63.21,95.02 12V.A
  Bottom 0.61: v16.3,41.1 v20.4,41.1 | v21.8,77.6 22,77.8 v22,94
  Bottom 0.813: v79.4,13.4 79.4,7.64 80.04,7 | v83.4,63.5 83.4,55.4 84.9,53.9 v88.3,53.9
  Bottom 1.27: 1.4,80.34 1.4,81.6 2.3,82.5 3.56,82.5 JP4.22 | J1.1 56.65,97.15 55.8,98 42.8,98 41.4,96.6 J1.4
  Bottom 1.422: JP5.22 JP5.24 JP5.26 97.8,56.11 97.8,20.2 96.81,19.21 JP6.22 JP6.24 JP6.26 95.73,12.63 95.1,12 94,12 89,7 80.04,7 76.24,3.2 54.6,3.2 | 54.6,3.2 41.4,3.2 | 41.4,3.2 35.8,3.2 30.6,8.4 | J2.4 56.67,3.23 54.6,3.2 | J2.1 41.4,7.36 41.4,3.2 | U$1.INP#2 U$1.INP#1
  Bottom 1.676: 30.6,8.4 5,8.4 1.3,12.1 1.3,37.9 1.96,38.56 JP3.22 JP3.24 JP3.26 3.57,53.33 1.4,55.5 1.4,80.34 | JP4.26 JP4.24 JP4.22
A-1  (via drill 0.5)
  Top 0.406: U_OCA.1 30.18,29.5 v28.3,29.5
  Bottom 0.406: v28.3,29.5 28.6,29.5 28.8,29.7 28.8,31.4 29.48,32.09 SHIFTOUTA.15
A-2  (via drill 0.5)
  Top 0.406: v27.5,30.8 U_OCA.2
  Bottom 0.406: SHIFTOUTA.1 24.87,30.8 v27.5,30.8
A-3  (via drill 0.5)
  Top 0.406: v26.9,32.1 30.16,32.1 U_OCA.3
  Bottom 0.406: SHIFTOUTA.2 24.87,32.1 v26.9,32.1
A-4  (via drill 0.5)
  Top 0.406: v27.5,33.3 30.17,33.3 U_OCA.4
  Bottom 0.406: SHIFTOUTA.3 24.83,33.3 v27.5,33.3
A-5  (via drill 0.5)
  Top 0.406: v26.9,34.6 U_OCA.5
  Bottom 0.406: SHIFTOUTA.4 25.27,34.62 25.3,34.6 v26.9,34.6
A-6  (via drill 0.5)
  Top 0.406: v27.5,35.9 30.17,35.9 U_OCA.6
  Bottom 0.406: SHIFTOUTA.5 v27.5,35.9
A-7  (via drill 0.5)
  Top 0.406: v26.9,37.1 30.16,37.1 U_OCA.7
  Bottom 0.406: SHIFTOUTA.6 24.82,37.1 v26.9,37.1
A-8  (via drill 0.5)
  Top 0.406: v27.5,38.4 U_OCA.8
  Bottom 0.406: SHIFTOUTA.7 24.85,38.4 v27.5,38.4
B-1  (via drill 0.6)
  Top 0.406: U_OCA1.1 v29.7,66
  Bottom 0.406: v29.7,66 31.4,66 32.4,67 32.4,69 31.8,69.6 30.43,69.6 SHIFTOUTB.15
B-2  (via drill 0.5)
  Top 0.406: v26.1,68.3 29.61,68.3 U_OCA1.2
  Bottom 0.406: SHIFTOUTB.1 24.22,68.3 v26.1,68.3
B-3  (via drill 0.5)
  Top 0.406: v26.7,69.6 29.64,69.6 U_OCA1.3
  Bottom 0.406: SHIFTOUTB.2 24.25,69.6 v26.7,69.6
B-4  (via drill 0.5)
  Top 0.406: v26.1,70.9 29.67,70.9 U_OCA1.4
  Bottom 0.406: SHIFTOUTB.3 24.25,70.9 v26.1,70.9
B-5  (via drill 0.5)
  Top 0.406: v26.7,72.2 U_OCA1.5
  Bottom 0.406: SHIFTOUTB.4 24.22,72.2 v26.7,72.2
B-6  (via drill 0.5)
  Top 0.406: v26.1,73.5 29.67,73.5 U_OCA1.6
  Bottom 0.406: SHIFTOUTB.5 24.19,73.5 v26.1,73.5
B-7  (via drill 0.5)
  Top 0.406: v26.7,74.7 29.66,74.7 U_OCA1.7
  Bottom 0.406: SHIFTOUTB.6 v26.7,74.7
B-8  (via drill 0.5)
  Top 0.406: v26.07,75.99 29.72,75.99 U_OCA1.8
  Bottom 0.406: SHIFTOUTB.7 24.27,75.99 v26.07,75.99
C-1  (via drill 0.5)
  Top 0.61: U_OCA2.1 42.98,53.84 v42.98,54.85
  Bottom 0.61: SHIFTOUTC.15 45.56,53.73 45.3,54 43.28,54 42.98,54.3 v42.98,54.85
C-2  (via drill 0.5)
  Top 0.406: v44.28,55.75 U_OCA2.2
  Bottom 0.406: SHIFTOUTC.1 44.28,58.18 v44.28,55.75
C-3  (via drill 0.5)
  Top 0.406: v45.58,56.35 45.58,53.09 U_OCA2.3
  Bottom 0.406: SHIFTOUTC.2 45.58,58.18 v45.58,56.35
C-4  (via drill 0.5)
  Top 0.406: v46.78,55.75 46.78,53.08 U_OCA2.4
  Bottom 0.406: SHIFTOUTC.3 46.78,58.22 v46.78,55.75
C-5  (via drill 0.5)
  Top 0.406: v48.08,56.35 U_OCA2.5
  Bottom 0.406: SHIFTOUTC.4 48.08,58.19 v48.08,56.35
C-6  (via drill 0.5)
  Top 0.406: v49.38,55.75 49.38,53.08 U_OCA2.6
  Bottom 0.406: SHIFTOUTC.5 v49.38,55.75
C-7  (via drill 0.5)
  Top 0.406: v50.68,56.35 50.68,53.11 U_OCA2.7
  Bottom 0.406: SHIFTOUTC.6 50.68,58.2 v50.68,56.35
C-8  (via drill 0.5)
  Top 0.406: v51.98,55.75 51.98,53.14 U_OCA2.8
  Bottom 0.406: SHIFTOUTC.7 51.98,58.23 v51.98,55.75
CE  (via drill 0.5, 0.6)  (1 unrouted)
  Top 0.61: SHIFT1.15 27.3,16.95 v27.3,15.4 | SHIFT3.15 43.27,37.37 43,37.1 | 43,37.1 v43,33.5 43,26.2 v46.9,22.3 | SHIFT5.15 68.5,20.53 v68.5,23 | SHIFT2.15 27.39,52.22 v27.37,50.77 | 43,37.1 39.9,40.2 39.9,44 v38.5,45.4 39.1,46 39.1,58.8 40,59.7 v40,75.4 | v40.8,89.6 40,88.8 v40,85.2 | SHIFT4.15 68.83,59.62 v68.4,59.2 | v62.8,55.9 v62.8,37.5 | JP1.5 49,19 48.5,19.5 v45,19.5 | v57.5,23 57.5,32.7 v58.3,33.5
  Bottom 0.61: v27.3,15.4 27.9,16 40.5,16 41,16.5 41,18.5 41.5,19 45,19 | v27.37,50.77 33.13,50.8 v38.5,45.4 | JP2.5 49,90.2 48.3,90.9 41.6,90.9 40.8,90.1 v40.8,89.6 | v40,85.2 v40,75.4 | v68.4,59.2 66.1,59.2 v62.8,55.9 | 45,19 45.5,19 46.9,20.4 v46.9,22.3 | v45,19.5 45,19 | v43,33.5 v58.3,33.5 | 58.8,33.5 60,33.5 62.8,36.3 v62.8,37.5 | v68.5,23 68.5,20.5 67.5,19.5 59,19.5 57.5,21 v57.5,23
CLK  (via drill 0.5, 0.6)
  Top 0.406: SHIFT2.2 27.39,61.98 v30.1,64.7 | SHIFT4.2 68.8,55.03 v68.8,57.7 | 50.56,37.4 50.5,37.37 | 56.7,47.4 v56.3,47.5 | v42.1,20.8 48.8,20.8 | 48.8,20.8 49,21 49,21.8 | JP1.3 51.54,18.06 48.8,20.8
  Top 0.61: SHIFT1.2 v27.34,25.72 | 49,21.8 49,36.8 49.56,37.37 50.5,37.37 SHIFT3.2 53.63,37.37 v53.7,37.3 | SHIFT5.2 68.5,14.29 v68.5,12.1 | 56.7,47.4 v56.7,37.3 | v42.1,20.8 41.7,21.2 41.7,36.9 38.8,39.8 38.8,43.1 37.2,44.7 37.2,46 37.6,46.4 v37.6,55.6 37.7,55.7 37.7,59 38.9,60.2 38.9,74.7 38.6,75 v38.6,76.5 | v38.6,89.9 v38.6,84.18
  Bottom 0.406: v68.8,57.7 68.4,58.1 66.7,58.1 66.3,57.7 66.3,55.1 58.8,47.6 56.4,47.6 v56.3,47.5 | v30.1,64.7 32.1,64.7
  Bottom 0.61: v27.34,25.72 27.34,23.26 28.7,21.9 41,21.9 v42.1,20.8 | v68.5,12.1 68.5,15.5 68,16 64,16 62.5,17.5 57,17.5 55.5,19 52.6,19 51.54,17.94 JP1.3 | v56.7,37.3 v53.7,37.3 | 32.1,64.7 37.6,59.2 v37.6,55.6 | JP2.3 51.54,89.66 49.2,92 40.5,92 38.6,90.1 v38.6,89.9 | v38.6,84.18 v38.6,76.5
D-1  (via drill 0.5)
  Top 0.406: U_OCA3.1 69.26,77.74 v69.3,77.6
  Bottom 0.406: v69.3,77.6 69.3,76.8 67.75,75.25 SHIFTOUTD.15
D-2  (via drill 0.5)
  Top 0.406: v70.29,76.46 66.9,76.46 U_OCA3.2
  Bottom 0.406: SHIFTOUTD.1 72.18,76.46 v70.29,76.46
D-3  (via drill 0.5)
  Top 0.406: v69.59,75.16 66.93,75.16 U_OCA3.3
  Bottom 0.406: SHIFTOUTD.2 72.21,75.16 v69.59,75.16
D-4  (via drill 0.5)
  Top 0.406: v70.19,73.96 66.92,73.96 U_OCA3.4
  Bottom 0.406: SHIFTOUTD.3 72.14,73.96 v70.19,73.96
D-5  (via drill 0.5)
  Top 0.406: v69.59,72.66 U_OCA3.5
  Bottom 0.406: SHIFTOUTD.4 72.77,72.66 v69.59,72.66
D-6  (via drill 0.5)
  Top 0.406: v70.19,71.46 67.56,71.46 U_OCA3.6
  Bottom 0.406: SHIFTOUTD.5 72.75,71.46 v70.19,71.46
D-7  (via drill 0.5)
  Top 0.406: v69.59,70.16 66.93,70.16 U_OCA3.7
  Bottom 0.406: SHIFTOUTD.6 v69.59,70.16
D-8  (via drill 0.5)
  Top 0.406: v70.19,68.86 66.9,68.86 U_OCA3.8
  Bottom 0.406: SHIFTOUTD.7 72.76,68.86 v70.19,68.86
E-1  (via drill 0.5)
  Top 0.61: v68.6,36.3 68.49,36.19 U_OCA4.1
  Bottom 0.61: SHIFTOUTE.15 67.34,33.65 67.8,34.1 67.8,35.5 v68.6,36.3
E-2  (via drill 0.5)
  Top 0.406: v69.42,34.91 U_OCA4.2
  Bottom 0.406: SHIFTOUTE.1 v69.42,34.91
E-3  (via drill 0.5)
  Top 0.406: v70.12,33.61 66.86,33.61 U_OCA4.3
  Bottom 0.406: SHIFTOUTE.2 71.99,33.61 v70.12,33.61
E-4  (via drill 0.5)
  Top 0.406: v69.42,32.31 66.89,32.31 U_OCA4.4
  Bottom 0.406: SHIFTOUTE.3 72.02,32.31 v69.42,32.31
E-5  (via drill 0.5)
  Top 0.406: v70.12,31.11 U_OCA4.5
  Bottom 0.406: SHIFTOUTE.4 v70.12,31.11
E-6  (via drill 0.5)
  Top 0.406: v69.52,29.81 66.85,29.81 U_OCA4.6
  Bottom 0.406: SHIFTOUTE.5 71.98,29.81 v69.52,29.81
E-7  (via drill 0.5)
  Top 0.406: v70.12,28.51 66.88,28.51 U_OCA4.7
  Bottom 0.406: SHIFTOUTE.6 72.01,28.51 v70.12,28.51
E-8  (via drill 0.5)
  Top 0.406: v69.52,27.31 U_OCA4.8
  Bottom 0.406: SHIFTOUTE.7 71.97,27.31 v69.52,27.31
GND  (via drill 0.5, 0.6)
  Top 0.406: v53.18,56.35 53.18,53.07 U_OCA2.9
  Top 0.61: SHIFT1.8 19.71,26.71 v20,27 | v69.03,80.22 69.03,80.3 63.5,80.3 63.5,79.42 v63.03,79.42
  Bottom 0.406: SHIFTOUTC.8 v53.18,56.35
  Bottom 0.61: SHIFTOUTB.8 23.82,77.68 C9.1 | JP2.9 42.75,87.8 37.1,87.8 35.1,89.8 v35.1,91.6
  other vias: 14,38 14,40 14,42 14,44 14,47 17,47 6,48 7,51 6,54 25,43 28,41 61.5,10 76,10 68,10 52.47,23.46 41.4,63.8 58,49 50.11,46.91 51.87,46.91 53,78 57,80 69.57,67.53 67.97,64.53 72.03,80.22 71,58 75,58 73,51.32 66.3,51.3 68,48 66.3,46.21 72,43 70,41 72,37 78.6,44.3 77,41 77,38 81,38 84,40 81,42 89,50 89,52 89,57 89,60 94,52 96,49 96,54 9.9,4.8 8.9,2.8 10.9,2.8 88.9,3.8 86.9,4.8 86.9,2.8 22.1,74 51,73 55,74 54,70 60,6 18,6 24,6 30,6 30,11 37,19 61.8,91.4 61.8,98.8 89,99 83.7,99.1 88.9,94.2 67.43,5.4 73.43,5.4 57.1,56.2 48.5,60.4 53.07,34.81 53.37,43.91 31.4,17.4 37.5,30.9 37.5,28.8 35.7,98 41.7,69.1
  pour Bottom: 99,102 0,102 0,0 99,0
  pour Top: 99,102 0,102 0,0 99,0
MR  (via drill 0.5, 0.6)
  Top 0.61: v35,76.5 34.8,76.3 v34.8,69.3 34.8,67.3 33.3,65.8 33.3,59.1 32.1,57.9 32.1,42.3 34.3,40.1 v34.3,38.6 v34.3,26.1 34.3,16.1 35.87,14.53 JP1.10 | v57.1,60 57.1,64.7 55.5,66.3 v53.6,66.3
  Bottom 0.61: SHIFTOUTB.10 34.47,75.97 v35,76.5 35,84.7 37,86.7 43.65,86.7 JP2.10 | v34.3,38.6 34.13,38.44 SHIFTOUTA.10 | SHIFTOUTE.10 46.3,27.3 45.1,26.1 v34.3,26.1 | SHIFTOUTC.10 51.91,50.48 52.2,50.2 54.1,50.2 55.9,52 55.9,60 v57.1,60 | v34.8,69.3 37.8,66.3 v53.6,66.3 56,66.3 56.9,65.4 60.1,65.4 63.59,68.89 SHIFTOUTD.10
N$8  (via drill 3.2)
  other vias: 95,4
N$9  (via drill 3.2)
  other vias: 4,4
N$10  (via drill 3.2)
  other vias: 95,98
N$11  (via drill 3.2)
  other vias: 4,98
N$12
  Bottom 1.016: 16.6,96.6 U$2.PAD1
  Bottom 1.27: U$1.OUTP#1 12.5,96.6 16.6,96.6
  Bottom 1.422: U$1.OUTP#2 U$1.OUTP#1
N$13
  Bottom 0.406: 12V.K 68.17,88.52 R9.1
N$17
  Bottom 0.406: 5V.K 76.27,90.52 R10.1
N$18  (via drill 0.5, 0.6)
  Top 0.61: SHIFT2.10 21.04,55.73 22,56.7 29,56.7 29.9,55.8 v29.9,43.9 | SHIFT3.9 44.85,45 42.3,45 41.2,43.9 v41.2,42.6
  Bottom 0.61: 30.3,43.9 v29.9,43.9 39.9,43.9 v41.2,42.6
N$21  (via drill 0.5, 0.6)
  Top 0.61: SHIFT3.10 46.67,43.7 v46.68,45.88 | v73.9,49.7 77.6,53.4 77.6,60 SHIFT4.9
  Bottom 0.61: v73.9,49.7 64,49.7 59.5,45.2 48.3,45.2 47.62,45.88 v46.68,45.88
N$22
  Top 0.61: SHIFT4.10 75.17,62.48 75.7,63 76.6,63 78.6,61 78.6,52.6 74.8,48.8 74.8,25.4 76.17,24.04 SHIFT5.9
N$26  (via drill 0.6)
  Top 0.61: v31,41.2 31,58.4 32.3,59.7 v32.3,70.7
  Bottom 0.61: SHIFTOUTA.9 31.03,41.17 v31,41.2 | v32.3,70.7 32.09,70.89 SHIFTOUTB.14
N$31  (via drill 0.6)
  Top 0.61: v54.6,58.8 v54.6,63.7
  Bottom 0.61: SHIFTOUTC.9 54.6,53.43 v54.6,58.8 | v54.6,63.7 55.1,63.2 61.2,63.2 64,66 74.8,66 76.1,67.3 76.1,77.4 74.6,78.9 68.8,78.9 67.5,77.6 63.8,77.6 62.9,76.9 62.9,75.4 64.3,74 65.95,74 SHIFTOUTD.14
N$37  (via drill 0.5, 0.6)
  Top 0.61: v52.3,65.1 55.1,65.1 55.9,64.3 55.9,53 54.1,51.2 46.8,51.2 46.8,50.5 46.5,50.2 v46.5,49.9 | v33,78 33.5,77.5 v33.5,68
  Bottom 0.61: SHIFTOUTC.14 46.8,51.98 46.8,50.5 46.5,50.2 v46.5,49.9 | v52.3,65.1 36.4,65.1 v33.5,68 | SHIFTOUTB.9 32.23,77.23 v33,78
N$38  (via drill 0.6)
  Top 0.61: v46.9,37.4 v46.9,32.2
  Bottom 0.61: SHIFTOUTD.9 63.99,67.62 60.6,64.3 56.1,64.3 55.5,64.9 54,64.9 52.4,63.3 43,63.3 40.2,60.5 40.2,50.5 46.9,43.8 v46.9,37.4 | SHIFTOUTE.14 64.42,32.38 64.25,32.2 v46.9,32.2
N$50
  Top 0.61: SHIFT2.9 19.77,44.84 22.2,42.4 22.2,27.8 22.7,27.3 28.6,27.3 29.8,26.1 29.8,19.7 29.1,19 21.4,19 20.98,18.59 SHIFT1.10
OE  (via drill 0.5, 0.6)
  Top 0.61: v61.6,16.2 v61.6,24.8 | v36.1,24.8 v36.1,32.7 v36.1,38 36.1,40 33.2,42.9 33.2,57.4 34.4,58.6 34.4,65.4 36.2,67.2 v36.2,70.7 | v48,49.9 54.7,49.9 58.3,53.5 58.3,65.1 55.9,67.5 v54.9,67.5 57.3,67.5 58.2,68.4 58.2,71.8 59.2,72.8 v61.1,72.8
  Bottom 0.61: 67.3,31.11 SHIFTOUTE.13 64.4,31.1 64.2,30.9 41.4,30.9 40.5,31.8 40.5,33.8 40.3,33.8 v36.1,38 36.3,38 | JP2.2 54.08,85.08 52.3,83.3 47,83.3 44,80.3 44,72.8 41.9,70.7 v36.2,70.7 | v36.2,70.7 34.74,72.16 SHIFTOUTB.13 | SHIFTOUTA.13 34.17,34.62 v36.1,32.7 | v61.6,24.8 v36.1,24.8 | SHIFTOUTC.13 48.1,50.6 | 48.1,50.6 | 48.1,50.6 48.1,50.01 v48,49.9 | v36.2,70.7 36.2,69.8 38.5,67.5 v54.9,67.5 | SHIFTOUTD.13 61.4,72.7 v61.1,72.8 | v61.6,16.2 61.6,14.9 61.23,14.53 JP1.2
OUTA1
  Top 0.406: JP3.2 4.83,11.9 16.9,11.9 18.7,13.7 18.7,28.8 19.42,29.52 U_OCA.18
OUTA2
  Top 0.406: U_OCA.17 19.09,30.79 18,29.7 18,15.1 17.3,14.4 4.87,14.4 JP3.4
OUTA3
  Top 0.406: U_OCA.16 19.26,32.06 17.3,30.1 17.3,17.5 16.8,17 4.81,17 JP3.6
OUTA4
  Top 0.406: U_OCA.15 19.43,33.33 16.6,30.5 16.6,19.8 16.3,19.5 4.85,19.5 JP3.8
OUTA5
  Top 0.406: U_OCA.14 19.5,34.6 15.9,31 15.9,22.3 15.6,22 4.89,22 JP3.10
OUTA6
  Top 0.406: U_OCA.13 19.57,35.87 15.2,31.5 15.2,24.8 15,24.6 4.82,24.59 JP3.12
OUTA7
  Top 0.406: U_OCA.12 19.54,37.14 14.5,32.1 14.5,27.5 14.1,27.1 4.87,27.1 JP3.14
OUTA8
  Top 0.406: U_OCA.11 19.51,38.41 13.8,32.7 13.8,30.1 13.4,29.7 4.81,29.7 JP3.16
OUTB1
  Top 0.406: U_OCA1.18 18.7,65.92 18.7,38.8 12.1,32.2 4.85,32.2 JP3.18
OUTB2
  Top 0.406: U_OCA1.17 18.79,68.39 18,67.6 18,39.7 13.03,34.73 4.86,34.73 JP3.20
OUTB3
  Top 0.406: U_OCA1.16 18.96,69.66 17.3,68 17.3,59.6 13.61,55.92 4.87,55.92 JP4.2
OUTB4
  Top 0.406: U_OCA1.15 19.13,70.93 16.6,68.4 16.6,61.3 13.7,58.4 4.89,58.41 JP4.4
OUTB5
  Top 0.406: U_OCA1.14 19.1,72.2 15.9,69 15.9,62.7 14.18,60.98 4.85,60.98 JP4.6
OUTB6
  Top 0.406: U_OCA1.13 18.97,73.47 15.2,69.7 15.2,65.2 13.5,63.5 4.9,63.5 JP4.8
OUTB7
  Top 0.406: U_OCA1.12 18.94,74.74 14.5,70.3 14.5,67.2 13.34,66.04 4.9,66.04 JP4.10
OUTB8
  Top 0.406: U_OCA1.11 19.01,76.01 13.8,70.8 13.8,69 13.4,68.6 4.88,68.6 JP4.12
OUTC1
  Top 0.406: JP4.14 4.92,71.1 13,71.1 14.9,73 14.9,74.7 19.9,79.7 37.4,79.7 43.4,73.7 43.4,64.8 43,64.4 U_OCA2.18
OUTC2
  Top 0.406: JP4.16 4.86,73.7 13.1,73.7 14.1,74.7 14.1,75.1 19.5,80.5 37.7,80.5 44.27,73.93 U_OCA2.17
OUTC3
  Top 0.406: JP4.18 4.9,76.2 14,76.2 19.1,81.3 38,81.3 45.1,74.2 45.1,64.4 45.54,63.96 U_OCA2.16
OUTC4
  Top 0.406: JP4.20 4.91,78.73 13.03,78.73 16.4,82.1 38.4,82.1 45.9,74.6 45.9,64.7 46.81,63.79 U_OCA2.15
OUTC5
  Top 0.406: JP5.2 94.39,90 82.7,90 77,84.3 72.7,84.3 72.1,83.7 52.8,83.7 46.7,77.6 46.7,65.5 48.08,64.12 U_OCA2.14
OUTC6
  Top 0.406: JP5.4 94.45,87.4 81.6,87.4 77.7,83.5 73.2,83.5 72.6,82.9 53.1,82.9 47.5,77.3 47.5,65.8 49.35,63.95 U_OCA2.13
OUTC7
  Top 0.406: JP5.6 94.47,84.84 80.84,84.84 78.7,82.7 73.8,82.7 73.2,82.1 53.4,82.1 48.3,77 48.3,66.1 50.62,63.78 U_OCA2.12
OUTC8
  Top 0.406: JP5.8 94.47,82.3 83.8,82.3 83.7,82.4 79.6,82.4 79.1,81.9 74.3,81.9 73.7,81.3 53.7,81.3 49.1,76.7 49.1,66.4 51.89,63.61 U_OCA2.11
OUTD1
  Top 0.406: U_OCA3.18 84.04,77.74 86.05,79.75 94.48,79.75 JP5.10
OUTD2
  Top 0.406: U_OCA3.17 85.07,76.47 85.8,77.2 94.49,77.2 JP5.12
OUTD3
  Top 0.406: U_OCA3.16 85.5,75.2 86.03,74.67 94.48,74.67 JP5.14
OUTD4
  Top 0.406: U_OCA3.15 84.17,73.93 86,72.1 94.51,72.1 JP5.16
OUTD5
  Top 0.406: U_OCA3.14 82.94,72.66 86,69.6 94.47,69.6 JP5.18
OUTD6
  Top 0.406: U_OCA3.13 81.51,71.39 85.86,67.05 94.48,67.05 JP5.20
OUTD7
  Top 0.406: U_OCA3.12 80.58,70.12 85.5,65.2 85.5,48.2 94,48.2 95.8,46.4 95.8,44.68 JP6.2
OUTD8
  Top 0.406: U_OCA3.11 80.25,68.85 84.6,64.5 84.6,48.1 83.9,47.4 83.9,45 84.4,44.5 90.2,44.5 91.37,43.33 94.47,43.33 JP6.4
OUTE1
  Top 0.406: U_OCA4.18 83.89,36.19 86,38.3 94.5,38.3 JP6.6
OUTE2
  Top 0.406: U_OCA4.17 85.32,34.92 86.1,35.7 94.44,35.7 JP6.8
OUTE3
  Top 0.406: U_OCA4.16 85.55,33.65 86,33.2 94.48,33.2 JP6.10
OUTE4
  Top 0.406: U_OCA4.15 85.02,32.38 85.4,32 85.4,31.2 85.9,30.7 94.52,30.7 JP6.12
OUTE5
  Top 0.406: U_OCA4.14 84.09,31.11 85.4,29.8 85.4,28.7 86,28.1 94.46,28.1 JP6.14
OUTE6
  Top 0.406: U_OCA4.13 83.86,29.84 84.5,29.2 84.5,26.9 85.8,25.6 94.5,25.6 JP6.16
OUTE7
  Top 0.406: U_OCA4.12 83.53,28.57 83.7,28.4 83.7,25.3 85.96,23.04 94.48,23.04 JP6.18
OUTE8
  Top 0.406: U_OCA4.11 82.5,27.3 82.9,26.9 82.9,23.7 86.1,20.5 94.48,20.5 JP6.20
PL  (via drill 0.5, 0.6)
  Top 0.406: SHIFT2.1 28.66,61.26 v31,63.6 | SHIFT4.1 67.6,55.05 v67.6,57
  Top 0.61: v28.6,25 SHIFT1.1 | SHIFT5.1 67.24,14.3 65.2,14.3 64.8,14.7 v64.8,17.8 | SHIFT3.1 v51,21.2 | v58.3,46.5 58.3,35.4 56.1,33.2 v56.1,21.2 | v40.5,23.2 40.5,36.6 37.7,39.4 37.7,42.6 36.1,44.2 36.1,46.55 36.39,46.86 36.41,53.6 v36.41,56.53 36.41,59.41 37.8,60.8 37.8,74.2 37.2,74.8 v37.2,77.6 | JP2.7 46.46,91.74 45.6,92.6 39.1,92.6 37.2,90.7 v37.2,83.2
  Bottom 0.406: v67.6,57 67.6,55.1 59,46.5 v58.3,46.5 | v51,21.2 51,20 50,19 47,19 46.46,18.46 JP1.7
  Bottom 0.61: v28.6,25 28.6,23.8 29.2,23.2 v40.5,23.2 41.1,23.8 50.2,23.8 51,23 v51,21.2 v56.1,21.2 56.1,20.4 58,18.5 64.1,18.5 v64.8,17.8 | v31,63.6 31.5,63.6 36.4,58.7 v36.41,56.53 | v37.2,83.2 v37.2,77.6
Q7  (via drill 0.6)
  Top 0.61: v19.9,13.4 19.71,13.59 SHIFT1.9 | v41.6,11.5 55.5,11.5 56,12 56,16 54.93,17.07 JP1.1
  Bottom 0.61: v19.9,13.4 33.6,13.4 35.5,11.5 v41.6,11.5
Q7_2  (via drill 0.5, 0.6)
  Top 0.61: SHIFT5.10 74.89,23.8 73.8,24.9 73.8,48 70.3,51.5 68.2,51.5 65.9,53.8 65.9,57 63.5,59.4 63.5,74.8 60.8,77.5 v60.8,79.9 | v59.1,88.4 58.53,88.97 JP2.1
  Bottom 0.61: v60.8,79.9 60.8,86.7 v59.1,88.4
SHCP  (via drill 0.6)
  Top 0.61: v60.2,11.6 v60.2,28.5 61,29.3 v61,53.4 v61,70.1 | v39.1,33.3 v39.1,29.7 | v45.5,78.4 45.65,78.65 45.66,84.58 45.66,84.96 46.46,85.76 JP2.8
  Bottom 0.61: v60.2,11.6 58.3,9.7 48.3,9.7 46.46,11.54 JP1.8 | v60.2,28.5 59.47,28.57 | 59.47,28.57 SHIFTOUTE.11 | v61,70.1 61.06,70.17 | 61.06,70.17 SHIFTOUTD.11 | v39.1,29.7 40.23,28.57 59.47,28.57 | SHIFTOUTC.11 50.65,49.85 51.3,49.2 54.6,49.2 58.8,53.4 v61,53.4 | JP2.8 46.46,85.76 41.8,81.1 41.8,73.8 40.9,72.9 38.1,72.9 36.3,74.7 SHIFTOUTB.11 | 61.06,70.17 59.13,70.17 58.2,71.1 58.2,74.7 57.5,75.4 48.5,75.4 v45.5,78.4 | v39.1,33.3 35.23,37.16 SHIFTOUTA.11
SR_DS  (via drill 0.6)
  Top 0.61: v33,33.3 33,14.1 33.8,13.3 38.7,13.3 39.3,12.7 50.7,12.7 51.54,13.54 JP1.4
  Bottom 0.61: SHIFTOUTA.14 32.95,33.35 v33,33.3
SR_DS_2  (via drill 0.5, 0.6)
  Top 0.61: v65.8,24.5 64.8,25.5 64.8,56.4 62.4,58.8 62.4,74.1 59.4,77.1 v59.4,78.9 | v58.84,86.03 57.61,84.8 52.3,84.8 51.54,85.56 JP2.4
  Bottom 0.61: SHIFTOUTE.9 v65.81,24.51 v65.8,24.5 | v59.4,78.9 59.4,85.48 v58.84,86.03
STCP  (via drill 0.6)
  Top 0.61: v59.8,71.4 v59.8,52.2 59.8,30.8 v58.84,29.84 v58.84,12.34 | v47.2,79.7 47.2,84.2 47.5,84.5 48.5,84.5 49,85 JP2.6
  Bottom 0.61: SHIFTOUTD.12 59.84,71.44 v59.8,71.4 59.8,74.8 58.1,76.5 50.4,76.5 v47.2,79.7 | SHIFTOUTA.12 34.7,35.9 40.8,29.8 57.8,29.8 v58.84,29.84 SHIFTOUTE.12 | v58.84,12.34 58.84,12.23 57.3,10.7 49.7,10.7 49,11.4 JP1.6 | SHIFTOUTC.12 49.38,49.52 50.7,48.2 55.1,48.2 59.1,52.2 v59.8,52.2 | SHIFTOUTB.12 35.48,73.42 37.1,71.8 41.4,71.8 42.9,73.3 42.9,80.7 46.7,84.5 48.5,84.5 49,85 JP2.6
VCC  (via drill 0.5, 0.6, 0.7)
  Top 0.406: v12.1,83.5 12.85,82.75 R8.2 | R7.2 12.85,77.55 12.8,77.6 13.6,77.6 v15,79
  Top 0.61: v30.4,28 31,27.4 31,19.1 28.89,16.99 SHIFT1.16 28.61,15.38 | v86.7,50.6 86.7,62.51 RN4.1 | v83.4,50.6 83.4,48.4 82.9,47.9 82.9,45.4 v82.6,45.1 | R2.2 v82.2,86.1 | v82.8,88.5 83,88.7 R1.2 | v65.3,79 64.3,78 v64.3,76.2 64.7,75.8 64.7,61.62 C6.2 67.56,61.62 SHIFT4.16 | 77.9,7.55 77.8,7.65 77.8,17.8 77.2,18.4 67.8,18.4 67.28,18.93 SHIFT5.16 65.39,20.48 C7.2 65.38,22.38 62.9,24.86 v62.9,33.7 | RN1.1 24.91,10.61 28.61,14.29 28.61,14.64 28.61,14.79 28.61,15.38 | RN2.1 11.66,49.84 12.56,48.94 v16.12,48.94 | v22.3,46.6 R5.2 R6.2 25.3,47.95 25.3,48 28.2,48 | v28.2,83.5 v12.1,83.5 | v44.9,34.9 44.87,34.93 | v48.2,47.2 v48.2,38.5 | v44.9,34.9 44.3,34.3 v44.3,27.3 | C2.2 28.61,15.38 | 28.2,48 C4.2 | 28.2,48 28.66,48 SHIFT2.16 | SHIFT3.16 44.9,36.09 v44.9,34.9
  Top 0.813: RN2.1 11.6,54.55
  Top 1.016: 77.9,7.55 79.45,7.55 81.8,9.9 v83.2,9.9
  Top 1.27: 39.22,4.02 39.2,4 | 39.2,4 16.4,4 11.75,8.65 RN1.1 | 39.2,4 62.15,4 65.8,7.65 77.8,7.65
  Bottom 0.406: v15,79 15,83.5 | 5V.A 73.73,94.03 74.3,94.6 82.6,94.6 85.2,92
  Bottom 0.61: 31.03,29.2 31.03,28.63 v30.4,28 31.1,27.3 v44.3,27.3 | 31.03,29.2 SHIFTOUTA.16 | 90.7,62.9 90.45,63.15 87.5,63.15 RN4.1 | v86.7,50.6 v83.4,50.6 | v82.6,45.1 83.4,45.9 R3.2 85.05,45.86 R4.2 | v64.3,76.2 64.61,76.52 SHIFTOUTD.16 | v62.9,33.7 64.11,34.91 SHIFTOUTE.16 65.81,36.08 C12.2 | RN2.1 9.11,54.61 8.9,54.4 | v16.12,48.94 v16.13,48.95 22.3,48.95 v22.3,46.6 | SHIFTOUTB.16 28.36,68.34 28.2,68.5 28.2,76 | 28.2,76 28.2,79.1 | 28.2,79.1 v28.2,83.5 | SHIFTOUTC.16 44.3,50.7 | 44.3,50.7 44.3,50.1 47.2,47.2 v48.2,47.2 | v48.2,38.5 48.2,36.3 46.8,34.9 v44.9,34.9 44.9,36.2 C5.2 | RN5.1 90.7,19.23 90.7,19.1 | 28.23,75.97 28.2,76 | 85.2,92 82.8,89.6 v82.8,88.5 82.8,86.7 v82.2,86.1 72.4,86.1 v65.3,79 65.3,80.88 C11.2 | C8.2 31.03,29.2 | C9.2 25.88,79.1 28.2,79.1 | C10.2 42.73,50.7 44.3,50.7
  Bottom 1.016: v83.2,9.9 90.7,17.4 90.7,19.1 90.7,62.9 90.7,92 85.2,92 | 8.9,75.2 8.4,75.7 8.4,82.6 9.24,83.37 9.4,83.5 v12.1,83.5 | 18.5,94.8 18.54,94.8 U$2.PAD2
  Bottom 1.27: 8.9,75.2 8.9,54.4 8.9,11.2 9.49,10.61 RN1.1
  Bottom 1.422: 18.5,83.5 15,83.5 v12.1,83.5 | 18.54,83.5 18.5,83.5 | 18.5,83.5 18.5,94.8

### Text on the board
Top: HA-IO-MODULE | VERSION 3-REV1 | M2M TRITRONIK